# EAGLE design led_dice (EAGLE 9.6.2)

## Sheet 1 of 2
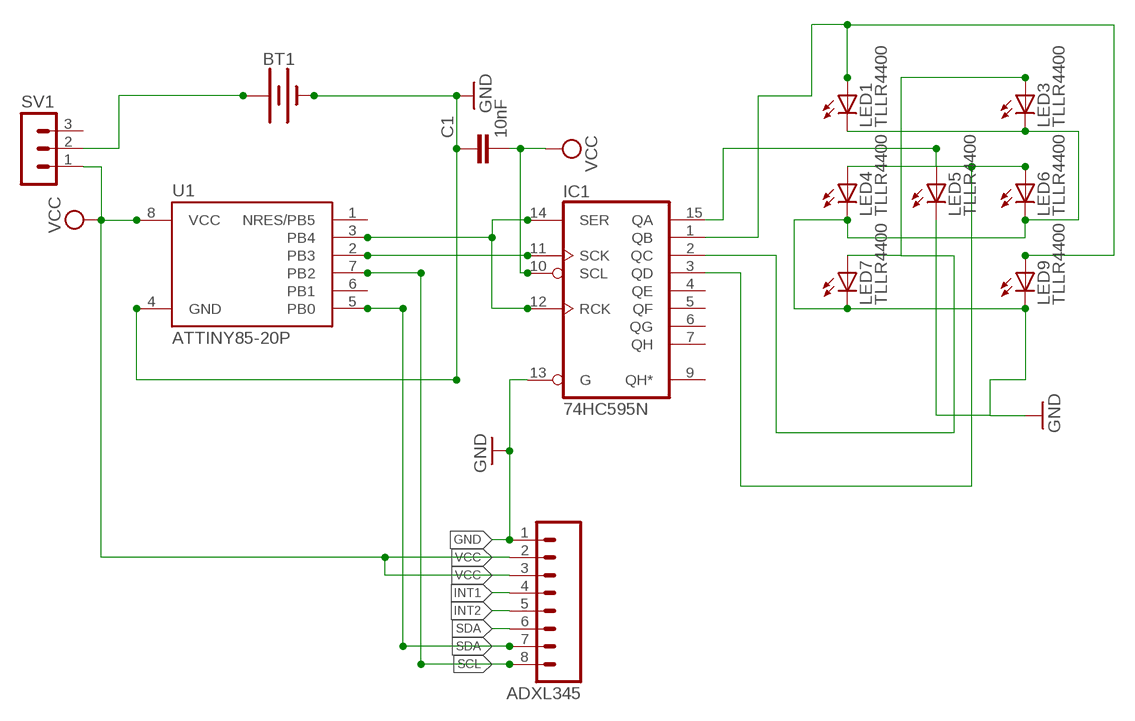
[diagram p0: schematic, sheet 1]

### Parts
ADXL345  M08  [1X08]
BT1  BATTERY-20MM_PTH  [BATTCOM_20MM_PTH]
C1  10nF  C-EU025-024X044  [C025-024X044]
IC1  74HC595N  [DIL16]
LED1  TLLR4400  [LED3MM]
LED3  TLLR4400  [LED3MM]
LED4  TLLR4400  [LED3MM]
LED5  TLLR4400  [LED3MM]
LED6  TLLR4400  [LED3MM]
LED7  TLLR4400  [LED3MM]
LED9  TLLR4400  [LED3MM]
SV1  MA03-1  [MA03-1]
U1  ATTINY85-20P  [PDIP08_300MIL]

### Nets
GND: ADXL345.1 BT1.2(-) C1.1 IC1.13(G) LED1.K(C) LED3.K(C) LED4.K(C) LED5.K(C) LED6.K(C) LED7.K(C) LED9.K(C) U1.4(GND)
INT1: ADXL345.4
INT2: ADXL345.5
N$2: IC1.1(QB) LED1.A LED9.A
N$3: IC1.15(QA) LED5.A
N$4: IC1.11(SCK) U1.2(PB3)
N$5: IC1.3(QD) LED4.A LED6.A
N$6: BT1.1(+) SV1.2
N$7: IC1.2(QC) LED3.A LED7.A
N$8: IC1.12(RCK) IC1.14(SER) U1.3(PB4)
N$10: ADXL345.6
SCL: ADXL345.8 U1.7(PB2)
SDA: ADXL345.7 U1.5(PB0)
VCC: ADXL345.2 ADXL345.3 C1.2 IC1.10(SCL) SV1.1 U1.8(VCC)
Unconnected: IC1.4(QE) IC1.5(QF) IC1.6(QG) IC1.7(QH) IC1.9(QH*) SV1.3 U1.1(NRES/PB5) U1.6(PB1)

## Sheet 2 of 2

## Power pins joined to a net without a drawn wire
GND: IC1.8(GND)
VCC: IC1.16(VCC)

## Library data of the parts
ADXL345 = SparkFun:M08: Header 8 Standard 8-pin 0.1" header. Use with straight break away headers (SKU : PRT-00116), right angle break away headers (PRT-00553), swiss pins (PRT-00743), machine pins (PRT-00117), and female headers (PRT-00115).
BT1 = SparkFun-Batteries:BATTERY: Battery - Single Cell A variety of battery chemistries, sizes, and footprints. Device List: 20MM_PTH - Coin Cell Battery Holder - 20mm (PTH) <https://www.sparkfun.com/products/783> 6.8MM_PTH - Coin Cell Battery Holder - 6.8MM(SMD) <https://www.digikey.com/product-detail/en/seiko-instruments/MS621FE-FL11E/728-1057-ND/1889208?WT.srch=1&gclid=CNOQ5a6LzdQCFZS2wAodXCkE0g> 12MM_SMD - Coin Cell Battery Holder - 12mm (SMD) <https://www.sparkfun.com/products/10592> 12MM_PTH - Coin Cell Battery Holder - 12mm (PTH) <https://www.sparkfun.com/products/7948> 20MM_SMD - 20mm Coin Cell Battery Holder (SMD) (2 legs) Used on the Big Time Watch Kit <https://www.sparkfun.com/products/11734> 20MM_SMD_4LEGS - Coin Cell Battery Holder - 20mm (SMD) <https://www.sparkfun.com/products/11892> 20MM_SMD_4LEGS_OVERPASTE - Coin Cell Battery Holder - 20mm (SMD) <https://www.sparkfun.com/products/11892> (Over-paste on the legs) 24.5MM_PTH - Coin Cell Battery Holder - 24.5mm (PTH) <https://www.sparkfun.com/products/8863> 9V - 9V Battery Holder - PC Mount Used on the SparkFun SparkPunk Sound Kit <https://www.sparkfun.com/products/11177> and SparkFun SparkPunk Sequencer Kit <https://www.sparkfun.com/products/12707> 18650 - Battery Holder - 18650 (PTH) <https://www.sparkfun.com/products/13113> AA - Battery Holder - 1xAA (PTH) <https://www.sparkfun.com/products/7949> AAA - Battery Holder - 1xAAA (PTH) <https://www.sparkfun.com/products/12718> AA_KIT - Battery Holder - 1xAA (PTH) <https://www.sparkfun.com/products/7949> Special kit package - pads only have exposed copper on one side of the board. AAA_KIT - Battery Holder - 1xAAA (PTH) <https://www.sparkfun.com/products/12718> Special kit package - pads only have exposed copper on one side of the board.; PROD_ID: BATT-09031; SF_SKU: PRT-00783
C1 = resistor:C-EU: CAPACITOR, European symbol
IC1 = 74xx-eu:74*595: 8-bit SHIFT REGISTER, output latch
LED1 LED3-LED7 LED9 = led:TLLR4400: Low Current (2mA) LED 3 mm Tinted Diffused Package color RED Source: Data sheet <http://www.farnell.com/datasheets/391100.pdf>; MF: VISHAY SEMICONDUCTOR; OC_FARNELL: 1612437
SV1 = con-lstb:MA03-1: PIN HEADER; OC_FARNELL: unknown; OC_NEWARK: unknown
U1 = _hhn_attiny25_45_85:ATTINY85*: ATMEL ATtiny 85 Packages: P = PDIP 08 30mil S = SOIC 08 EIAJ 208mil Technologies Note: for complete ordering code (temp. range, finish, tape&reel etc.) see www.atmel.com • Supply Voltage: V = (1.8…5.5)V | [blank] = (2.7…5.5)V • Speed: 10 = 10 MHz | 20 = 20 MHz Author: Dipl.-Ing. FH Rainer Bayer HHN Hochschule Heilbronn (Heilbronn University), rainer.bayer@hs-heilbronn.de Ingenieurbüro ing-rb, mail@ing-rb.de

## Board
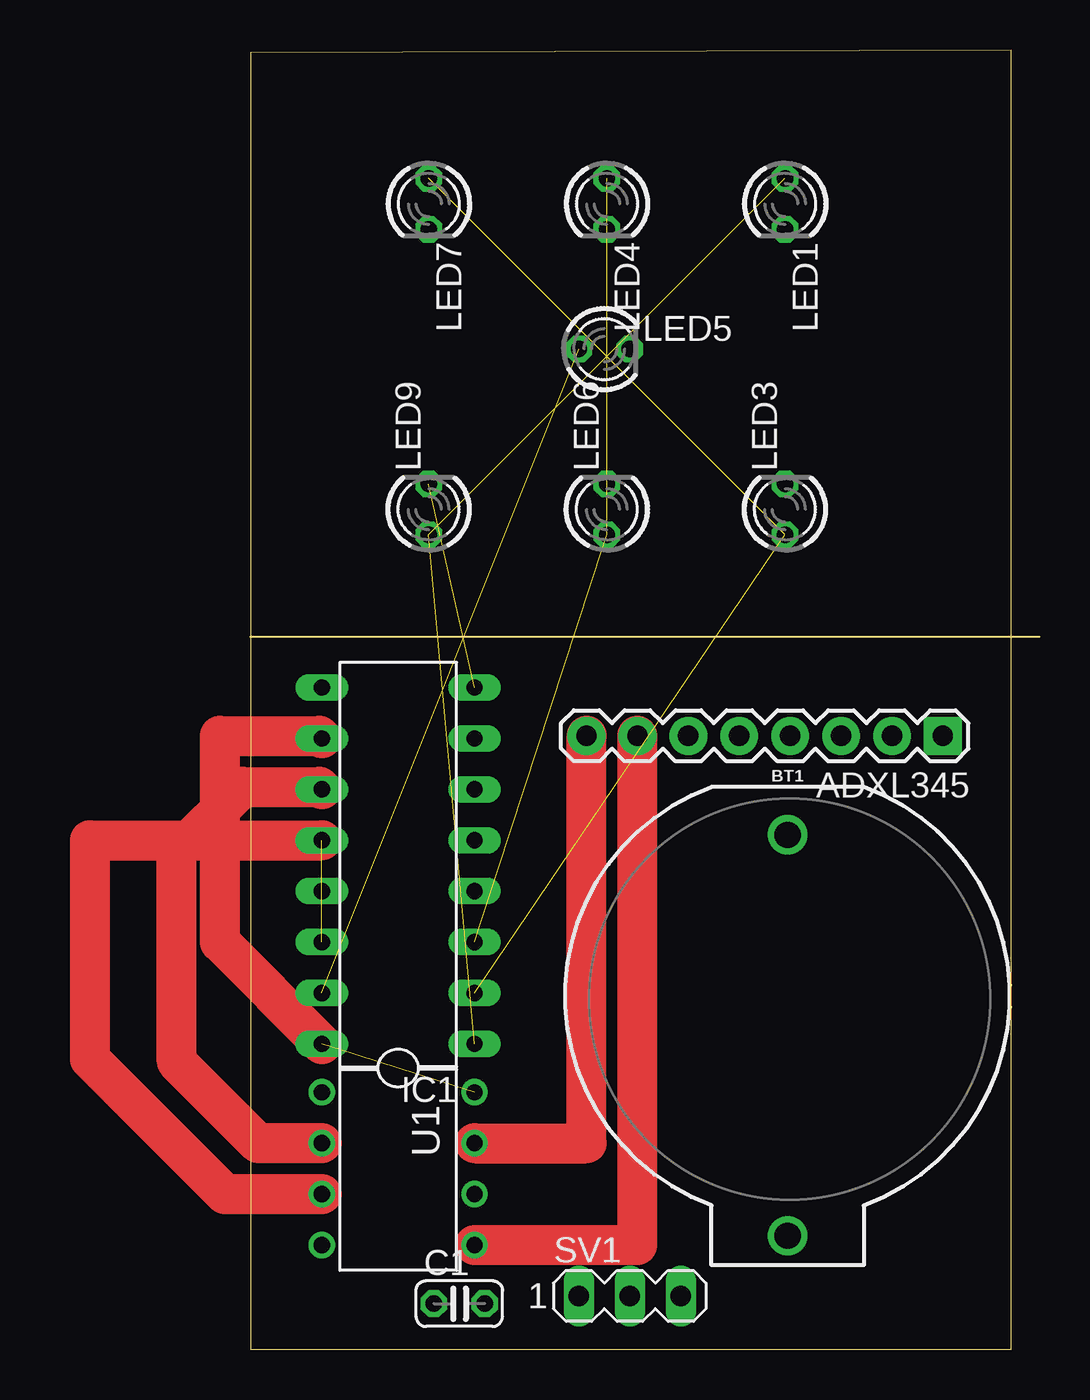
[diagram p1: board, top side]
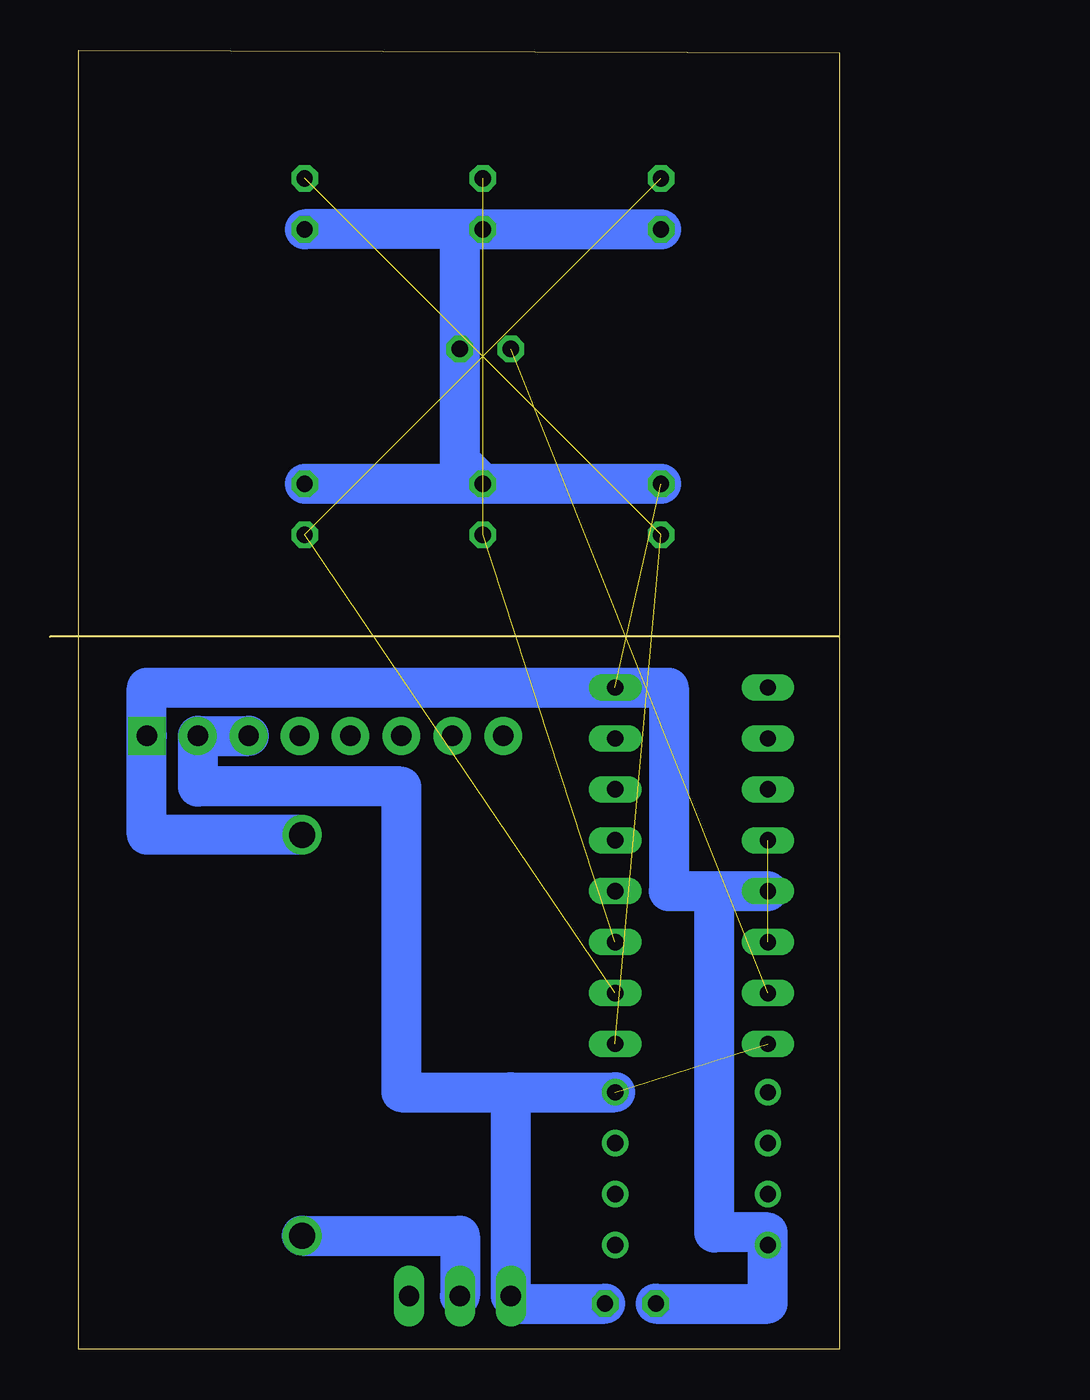
[diagram p2: board, bottom side, seen from below]

Size 39.37 x 64.82 mm. Coordinates in mm from the lower left corner, seen from the top.
Outline: 0,35.56 0,64.69 37.95,64.82 37.95,0 0,0 0,35.56
Outline: 0,35.56 39.37,35.56
Copper layers (1*16): Top 0.035mm / dielectric 1.5mm / Bottom 0.035mm
Design rules "default *": minimum track width 6mil, minimum drill 0.35mm, track to track 16mil, track to pad 6mil, pad to pad 6mil, via to via 6mil, smd to smd 6mil, copper to edge 2mil, drill to drill 6mil, minimum pad ring 10mil, minimum via ring 8mil, stop-mask expansion 4mil, vias tented up to drill 0mil, thermal gap 10mil

### Footprints (pad centres in the part's own frame; a part is rotated, then mirrored left to right if it is on the bottom)
1X08 = drill 1.016 pad 1.88 square: 1 0,0 | drill 1.016 pad 1.88: 2 2.54,0; 3 5.08,0; 4 7.62,0; 5 10.16,0; 6 12.7,0; 7 15.24,0; 8 17.78,0
BATTCOM_20MM_PTH = drill 1.3: 1 11.85,0; 2 -8.15,0
C025-024X044 = drill 0.813 octagon: 1 -1.27,0; 2 1.27,0
DIL16 = drill 0.813 long: 1 -8.89,-3.81; 2 -6.35,-3.81; 3 -3.81,-3.81; 4 -1.27,-3.81; 5 1.27,-3.81; 6 3.81,-3.81; 7 6.35,-3.81; 8 8.89,-3.81; 9 8.89,3.81; 10 6.35,3.81; 11 3.81,3.81; 12 1.27,3.81; 13 -1.27,3.81; 14 -3.81,3.81; 15 -6.35,3.81; 16 -8.89,3.81
LED3MM = drill 0.813 octagon: A -1.27,0; K 1.27,0
MA03-1 = drill 1.016 long: 1 -2.54,0; 2 0,0; 3 2.54,0
PDIP08_300MIL = drill 0.813: 1 -3.81,-3.81; 2 -1.27,-3.81; 3 1.27,-3.81; 4 3.81,-3.81; 5 3.81,3.81; 6 1.27,3.81; 7 -1.27,3.81; 8 -3.81,3.81

### Placement (x,y rotation side)
ADXL345  34.54,30.61 180 top
BT1  26.8,17.53 270 top
C1  10.41,2.29 0 top
IC1  7.37,24.13 90 top
LED1  26.67,57.15 270 top
LED3  26.67,41.91 90 top
LED4  17.78,57.15 270 top
LED5  17.65,49.91 0 top
LED6  17.78,41.91 90 top
LED7  8.89,57.15 270 top
LED9  8.89,41.91 90 top
SV1  18.92,2.67 0 top
U1  7.37,9.02 270 top

### Tracks (layer width: path | path; a pad name or v marks a point on that pad's centre or on a via)
GND  (1 unrouted)
  Bottom 2: C1.1 3.56,2.29 U1.4 3.56,5.83 6.23,5.83 6.23,22.23 6.22,22.23 6.22,22.86 | LED9.K LED6.K | LED6.K LED3.K | LED6.K 18.92,44.32 LED5.K 18.92,55.88 LED4.K | LED4.K LED7.K | LED4.K LED1.K | BT1.2 34.54,25.68 ADXL345.1 34.54,33.02 IC1.8 8.5,33.02 8.5,22.86 6.22,22.86 | 6.22,22.86 IC1.13
N$2  (2 unrouted)
N$3  (1 unrouted)
N$4
  Top 2: U1.2 0.38,10.29 -3.68,14.35 -3.68,24.77 -0.38,28.07 3.43,28.07 IC1.11
N$5  (2 unrouted)
N$6
  Bottom 2: BT1.1 18.92,5.68 SV1.2
N$7  (2 unrouted)
N$8  (1 unrouted)
  Top 2: U1.3 -1.27,7.75 -8,14.48 -8,25.4 IC1.12
SCL
  Top 2: U1.7 16.76,10.29 ADXL345.8
SDA
  Top 2: U1.5 19.3,5.21 ADXL345.7
VCC  (1 unrouted)
  Top 2: IC1.16 -1.52,20.32 -1.52,30.61 3.43,30.61 IC1.10
  Bottom 2: 16.38,12.83 U1.8 | C1.2 16,2.29 SV1.1 16.38,12.83 | ADXL345.3 ADXL345.2 32,28.08 21.85,28.08 21.85,12.83 16.38,12.83

### Text on the board
Measures: 3.85cm | 3.80cm